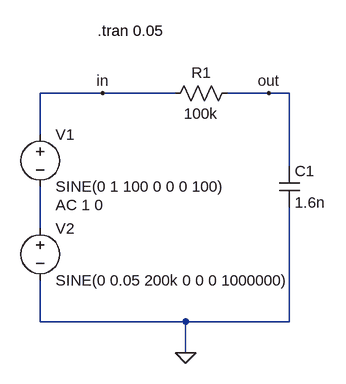
[diagram p0: schematic Priklad1.asc]
Priklad1.asc, the LTspice schematic file:
Version 4
SHEET 1 880 680
WIRE 16 -48 -80 -48
WIRE 128 -48 16 -48
WIRE 272 -48 208 -48
WIRE 304 -48 272 -48
WIRE -80 16 -80 -48
WIRE 304 64 304 -48
WIRE -80 160 -80 96
WIRE -80 304 -80 240
WIRE 144 304 -80 304
WIRE 304 304 304 128
WIRE 304 304 144 304
WIRE 144 352 144 304
FLAG 144 352 0
FLAG 16 -48 in
FLAG 272 -48 out
SYMBOL voltage -80 0 R0
WINDOW 123 24 124 Left 2
WINDOW 39 0 0 Left 2
SYMATTR InstName V1
SYMATTR Value SINE(0 1 100 0 0 0 100)
SYMATTR Value2 AC 1 0
SYMBOL voltage -80 144 R0
WINDOW 123 0 0 Left 2
WINDOW 39 0 0 Left 2
SYMATTR InstName V2
SYMATTR Value SINE(0 0.05 200k 0 0 0 1000000)
SYMBOL res 224 -64 R90
WINDOW 0 0 56 VBottom 2
WINDOW 3 32 56 VTop 2
SYMATTR InstName R1
SYMATTR Value 100k
SYMBOL cap 288 64 R0
SYMATTR InstName C1
SYMATTR Value 1.6n
TEXT 8 -144 Left 2 !.tran 0.05

The netlist it stands for:
* Priklad1.asc
V1 in N001 SINE(0 1 100 0 0 0 100) AC 1 0
V2 N001 0 SINE(0 0.05 200k 0 0 0 1000000)
R1 out in 100k
C1 out 0 1.6n
.tran 0.05
.backanno
.end